# EAGLE design Grove - LED Strip driver V1.2 (EAGLE 6.4)
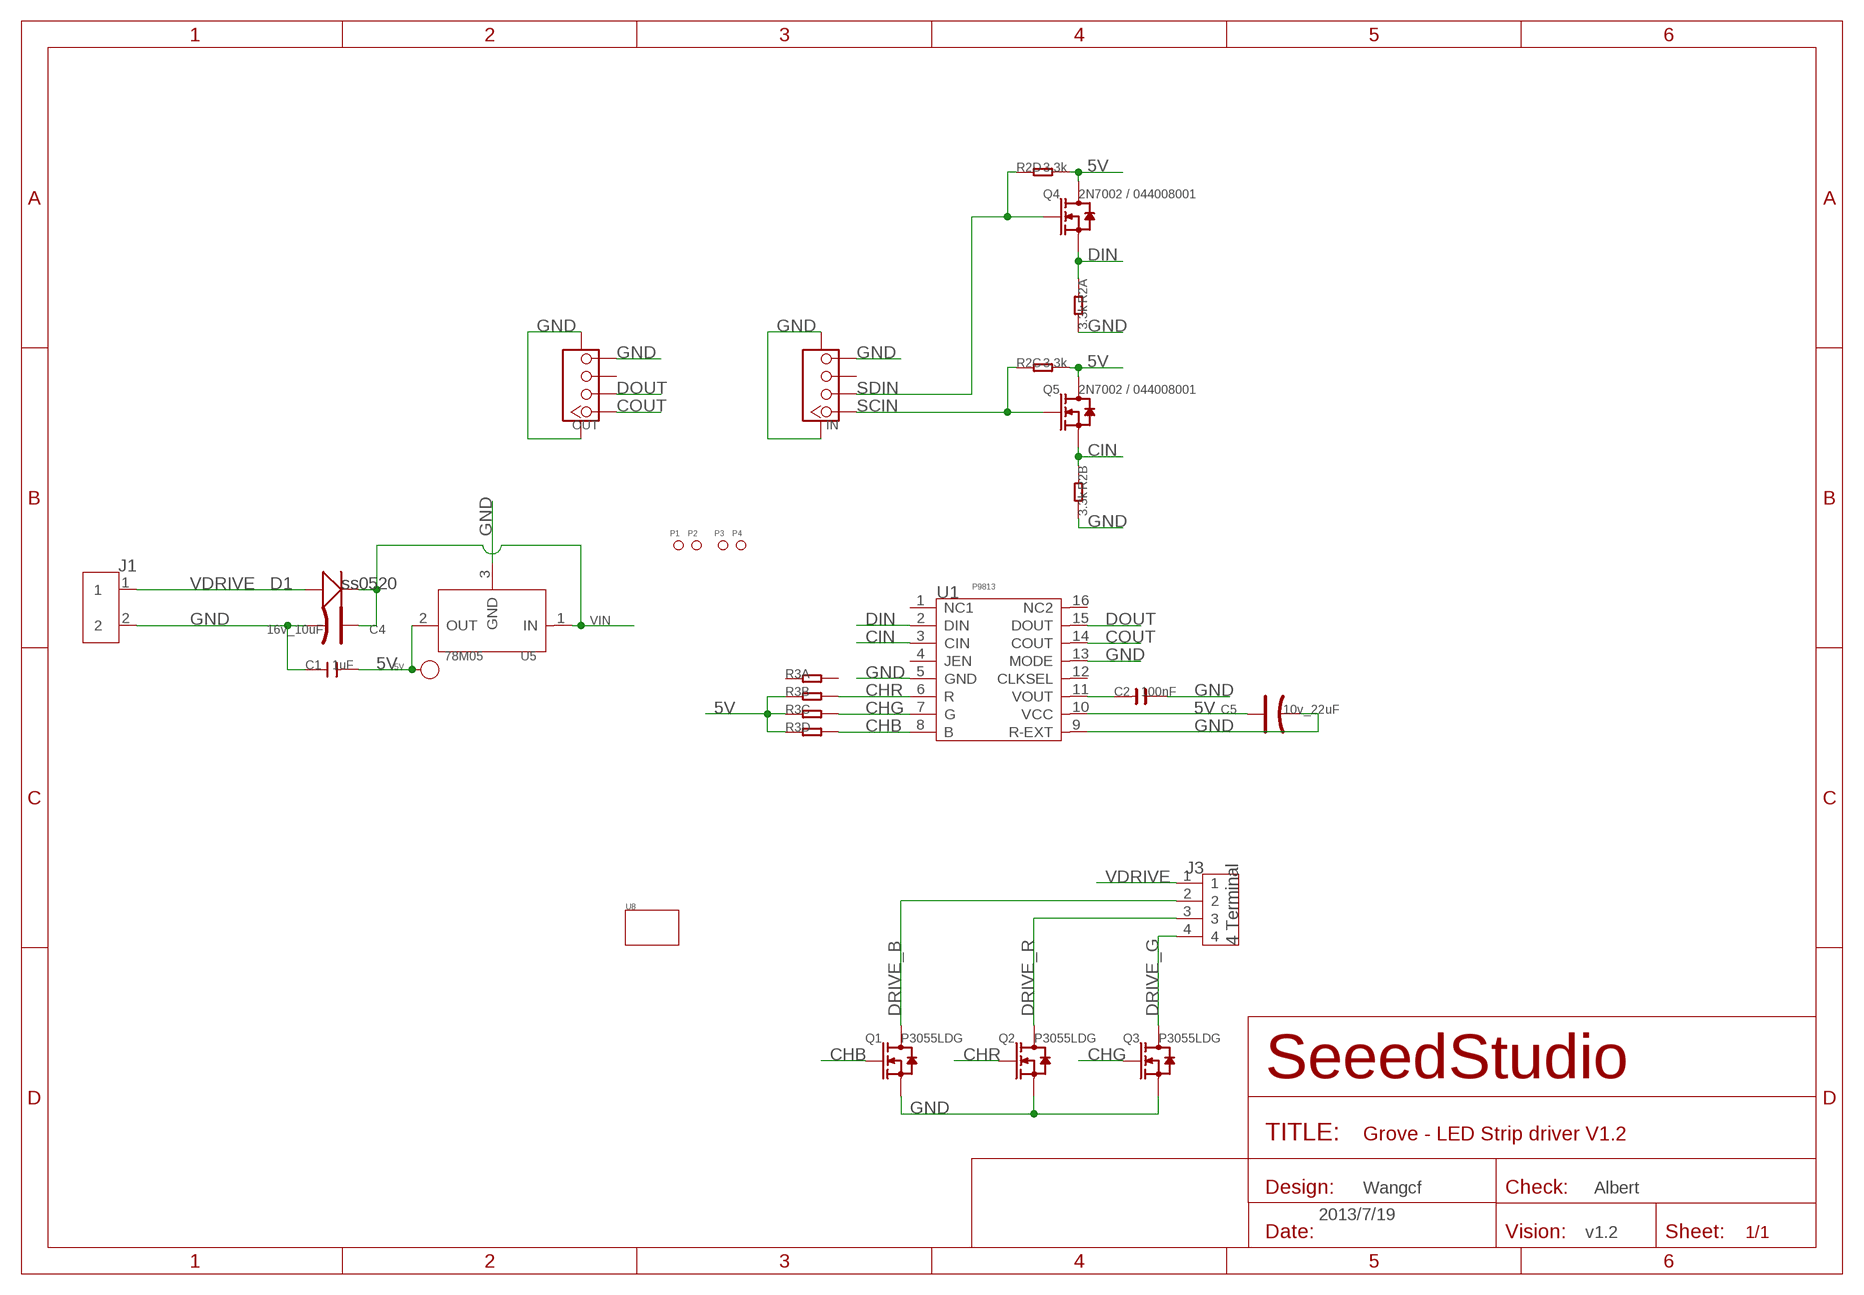
[diagram p0: schematic, sheet 1]

## Parts
5V  DNP  PAD-TEST-POINT'3535'  [TP_3535]
C1  1uF  C-0805  [C0805]
C2  100nF  C-0603  [C0603]
C4  16v_10uF  CAP-AVX-A  [AVX-A]
C5  10v_22uF  CAP-AVX-A  [AVX-A]
D1  ss0520  D'1206'  [SOD123]
IN  TWIG-4P-2.0-SMD-FEMALE-REINFORCE'DD'  [4P-SMD-2.0]
J1  SCREW-TERMINAL-2P'3.5'  [2P-3.5]
J3  4 Terminal  SCREW-TERMINAL-4P'3.5'  [4P-3.5]
OUT  TWIG-4P-2.0-SMD-FEMALE-REINFORCE'DD'  [4P-SMD-2.0]
P1  PAD-MARK  [ROUND-MARK-1.0]
P2  PAD-MARK  [ROUND-MARK-1.0]
P3  PAD-MARK  [ROUND-MARK-1.0]
P4  PAD-MARK  [ROUND-MARK-1.0]
Q1  P3055LDG  MOSFET-N'P3055LDG'  [TO252]
Q2  P3055LDG  MOSFET-N'P3055LDG'  [TO252]
Q3  P3055LDG  MOSFET-N'P3055LDG'  [TO252]
Q4  2N7002 / 044008001  MOSFET-N'SOT23'  [SOT23]
Q5  2N7002 / 044008001  MOSFET-N'SOT23'  [SOT23]
R2  3.3k  R-4R  [R1206-8]
R3  R-4R-1206  [1206-8-3.3X2.4]
U1  P9813  P9813-SSOP16  [SSOP16]
U5  78M05  78M05-TO252  [TO252]
U8  TWIG'3U'  [3U-DIM-W/-DRILL]

## Nets
5V: 5V.T C1.2 C5.+ Q4.3(D) Q5.3(D) R2.5 R2.6 R3.2 R3.3 R3.4 U1.10(VCC) U5.2(OUT)
CHB: Q1.1(G) R3.5 U1.8(B)
CHG: Q3.1(G) R3.6 U1.7(G)
CHR: Q2.1(G) R3.7 U1.6(R)
CIN: Q5.2(S) R2.2 U1.3(CIN)
COUT: OUT.1 U1.14(COUT)
DIN: Q4.2(S) R2.1 U1.2(DIN)
DOUT: OUT.2 U1.15(DOUT)
DRIVE_B: J3.2 Q1.2(D)
DRIVE_G: J3.4 Q3.2(D)
DRIVE_R: J3.3 Q2.2(D)
GND: C1.1 C2.2 C4.- C5.- IN.4 IN.SS1 IN.SS2 J1.2 OUT.4 OUT.SS1 OUT.SS2 Q1.3(S) Q2.3(S) Q3.3(S) R2.7 R2.8 U1.5(GND) U1.9(R-EXT) U1.13(MODE) U5.3(GND)
N$1: C2.1 U1.11(VOUT)
SCIN: IN.1 Q5.1(G) R2.3
SDIN: IN.2 Q4.1(G) R2.4
VDRIVE: D1.+ J1.1 J3.1
VIN: C4.+ D1.- U5.1(IN)
Unconnected: IN.3 OUT.3 R3.1 R3.8 U1.1(NC1) U1.4(JEN) U1.12(CLKSEL) U1.16(NC2)

## Notes on the sheet
- Wangcf | Albert
- 2013/7/19
- v1.2

## Library data of the parts
5V = Discrete:PAD-TEST-POINT; PARTNO: DNP
C1 = Discrete:C*: Ceramic Capacitors
C2 = OPL:C*
C4 C5 = Discrete:CAP*: Electrolytic Capacitors,Tantalum Capacitors and Super Capacitors
D1 = Discrete:D*
IN OUT = Connector :TWIG-4P-2.0-SMD-FEMALE-REINFORCE
J1 = Connector:SCREW-TERMINAL-2P
J3 = Connector:SCREW-TERMINAL-4P
P1-P4 = Discrete:PAD-MARK; PARTNO: DNP
Q1-Q5 = Discrete:MOSFET-N: IRLL014: http://www.vishay.com/docs/91319/sihll014.pdf
R2 = OPL:R-4R*: Resistor Array
R3 = Discrete:R-4R*: Resistor Array
U1 = IC:P9813-SSOP16
U5 = IC:78M05: 0.5A Three Terminal Positive Voltage Regulators
U8 = moudle:TWIG

## Board
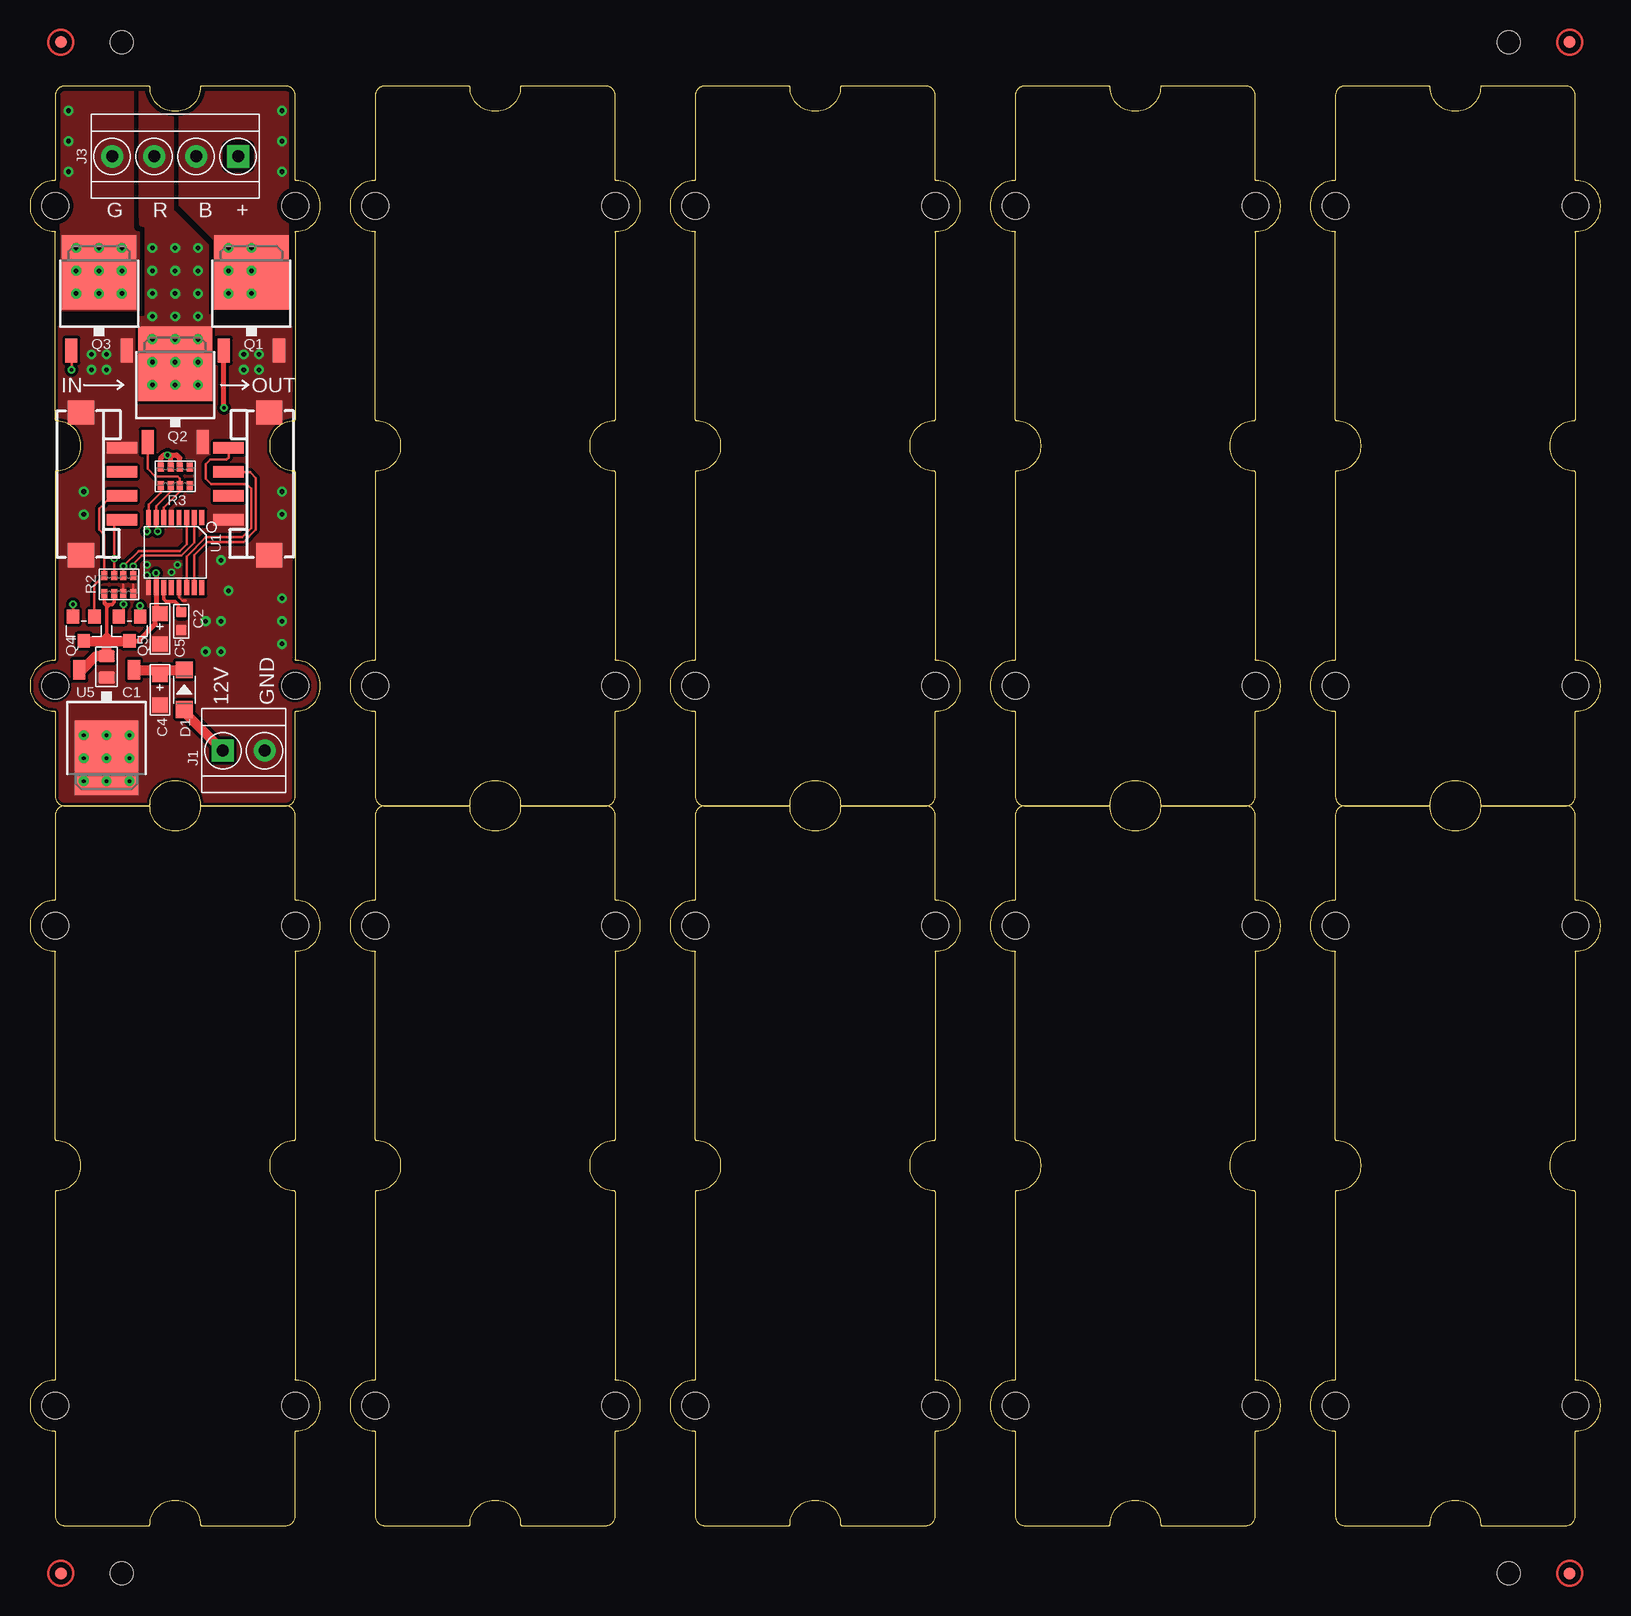
[diagram p1: board, top side]
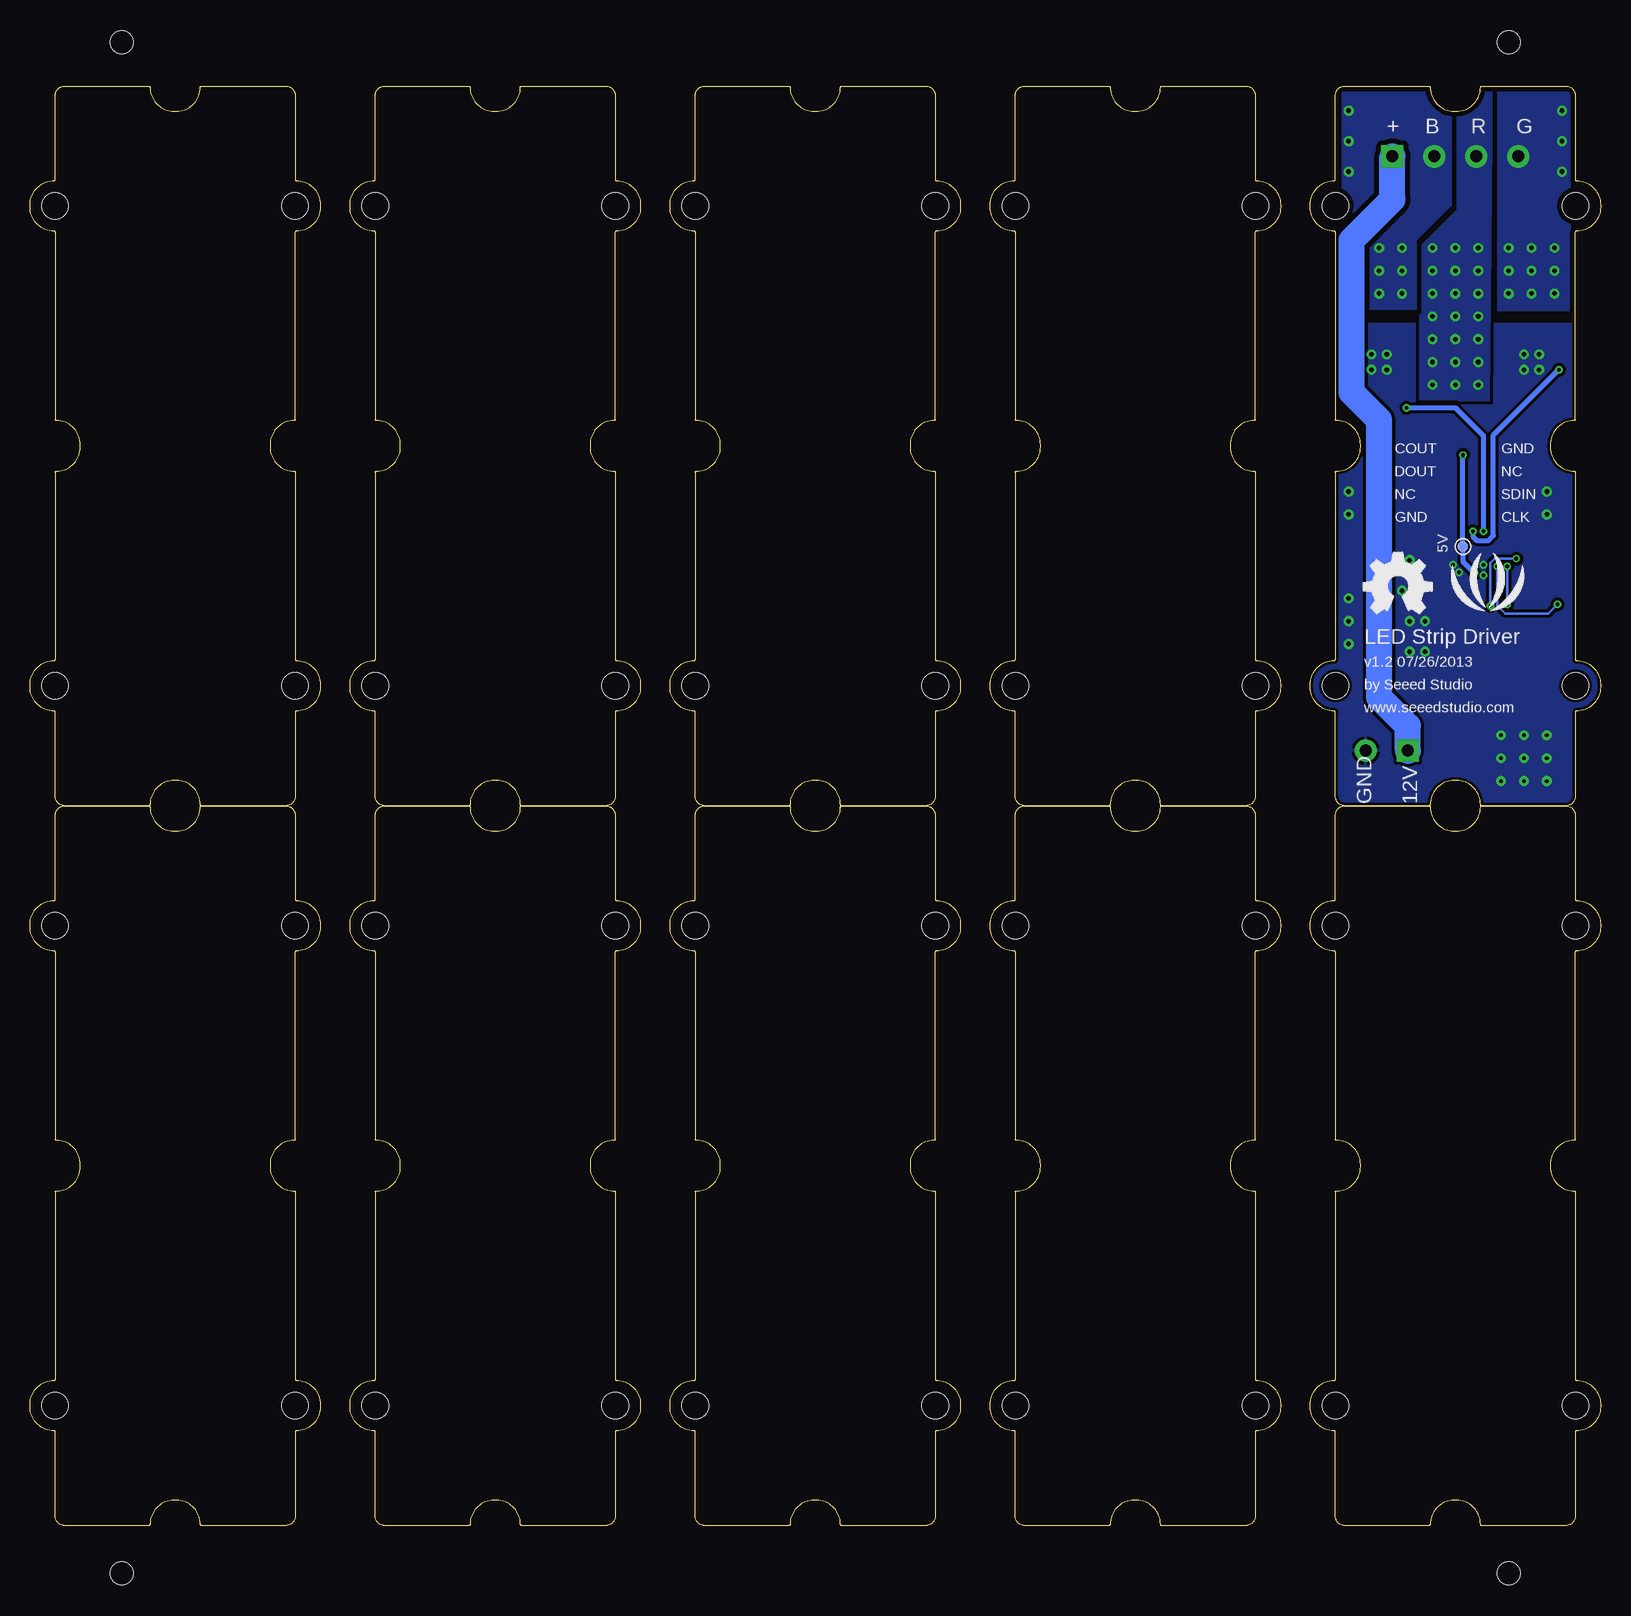
[diagram p2: board, bottom side, seen from below]

Size 130.88 x 120 mm. Coordinates in mm from the lower left corner, seen from the top.
Copper layers (1*16): Top 0.035mm / dielectric 1.5mm / Bottom 0.035mm
Design rules "SeeedStudio_DRU_no_angle_20130527 *": minimum track width 6mil, minimum drill 12mil, track to track 6mil, track to pad 6mil, pad to pad 6mil, via to via 6mil, smd to smd 0mil, copper to edge 10mil, drill to drill 10mil, minimum pad ring 10mil, minimum via ring 6mil, stop-mask expansion 2mil, vias tented up to drill 25mil, thermal gap 10mil
Holes 1.91 mm at 7.65,123.66 123.22,123.66 123.22,-3.98 7.65,-3.98
tRestrict: area 8.1,77.4 to 8.3,77.9

### Footprints (pad centres in the part's own frame; a part is rotated, then mirrored left to right if it is on the bottom)
TP_3535 = smd 0.889 x 0.889: T 0,0
C0805 = smd 1.016 x 1.397: 1 -0.889,0; 2 0.889,0
C0603 = smd 0.889 x 0.889: 1 -0.762,0; 2 0.762,0
AVX-A = smd 1.27 x 1.27: + -1.27,0; - 1.27,0
SOD123 = smd 1.397 x 1.397: + -1.651,0; - 1.651,0
4P-SMD-2.0 = smd 0.965 x 2.54: 1 -3,0; 2 -1,0; 3 1,0; 4 3,0 | smd 2.032 x 2.184: SS1 -5.946,3.4; SS2 5.946,3.4
2P-3.5 = drill 1 pad 1.85 square: 1 -1.75,0 | drill 1 pad 1.85: 2 1.75,0
4P-3.5 = drill 1 pad 1.85 square: 1 -5.25,0 | drill 1 pad 1.85: 2 -1.75,0; 3 1.75,0; 4 5.25,0
ROUND-MARK-1.0 = smd 1.016 x 1.016: P$1 0,0
TO252 = smd 1.016 x 2: 1 -2.3,-4.75; 3 2.3,-4.75 | smd 6.2 x 6.2: 2 0,1.75
SOT23 = smd 1.016 x 1.143: 1 -0.889,-1.016; 2 0.889,-1.016; 3 0,1.016
R1206-8 = smd 0.508 x 0.762: 1 -1.206,-0.762; 2 -0.381,-0.762; 3 0.381,-0.762; 4 1.206,-0.762; 5 1.206,0.762; 6 0.381,0.762; 7 -0.381,0.762; 8 -1.206,0.762
1206-8-3.3X2.4 = smd 0.508 x 0.762: 1 -1.206,-0.762; 2 -0.381,-0.762; 3 0.381,-0.762; 4 1.206,-0.762; 5 1.206,0.762; 6 0.381,0.762; 7 -0.381,0.762; 8 -1.206,0.762
SSOP16 = smd 0.406 x 1.27: 1 -2.223,-2.925; 2 -1.587,-2.925; 3 -0.953,-2.925; 4 -0.318,-2.925; 5 0.318,-2.925; 6 0.953,-2.925; 7 1.587,-2.925; 8 2.223,-2.925; 9 2.223,2.925; 10 1.587,2.925; 11 0.953,2.925; 12 0.318,2.925; 13 -0.318,2.925; 14 -0.953,2.925; 15 -1.587,2.925; 16 -2.223,2.925
3U-DIM-W/-DRILL = hole 2.2: 20,10; 20,-10; -20,-10; -20,10
TO252' = smd 1.016 x 1.651: 1 -2.286,-4.826; 2 2.286,-4.826 | smd 5.3 x 6.2: 3 0,2.5

### Placement (x,y rotation side)
5V  11.46,81.62 0 bottom
C1  6.38,71.59 90 top
C2  12.61,75.39 270 top
C4  10.83,69.68 270 top
C5  10.83,74.76 270 top
D1  12.86,69.68 90 top
IN  7.65,86.83 90 top
J1  17.81,64.6 0 top
J3  12.1,114.13 180 top
OUT  16.55,86.83 270 top
P1  2.57,-3.98 0 top  (outside the outline)
P2  128.31,-3.98 0 top  (outside the outline)
P3  2.57,123.66 0 top  (outside the outline)
P4  128.31,123.66 0 top  (outside the outline)
Q1  18.45,102.7 0 top
Q2  12.1,95.08 0 top
Q3  5.75,102.7 0 top
Q4  4.48,74.76 180 top
Q5  8.29,74.76 180 top
R2  7.4,78.44 180 top
R3  12.1,87.46 180 top
U1  12.1,81.11 180 top
U2  [3U-DIM-W/-DRILL]  12.1,30 270 top
U3  [3U-DIM-W/-DRILL]  12.1,90 270 top
U4  [3U-DIM-W/-DRILL]  38.77,30 270 top
U5  78M05  [TO252']  6.38,66.5 180 top
U6  [3U-DIM-W/-DRILL]  65.44,30 270 top
U7  [3U-DIM-W/-DRILL]  92.11,30 270 top
U8  118.78,30 270 top
U9  [3U-DIM-W/-DRILL]  38.77,90 270 top
U10  [3U-DIM-W/-DRILL]  65.44,90 270 top
U11  [3U-DIM-W/-DRILL]  92.11,90 270 top
U12  [3U-DIM-W/-DRILL]  118.78,90 270 top
U$1  [LOGO_SILK]  9.43,77.94 0 bottom
U$2  [OSHW_FILLX200_NOTEXT]  19.72,76.03 0 bottom

### Tracks (layer width: path | path; a pad name or v marks a point on that pad's centre or on a via)
5V  (via drill 0.3)
  Top 0.203: U5.2 4.23,71.2
  Top 0.305: 6.38,76.54 6.38,76.66 6.26,76.79 | R2.5 6.19,76.98 | 6.19,76.98 6.19,76.86 6.26,76.79 | R2.6 7.02,76.97 6.84,76.79 6.64,76.79 | 6.64,76.79 6.38,76.79 | 6.38,76.79 6.26,76.79 | 6.38,76.54 6.64,76.79 | 6.19,76.98 6.38,76.79 | 6.38,76.54 6.38,74.38 | 6.38,74.38 6.38,73.74 | 6.38,74.38 6.77,74 | 6.38,74.38 6,74
  Top 0.406: Q5.3 9.05,73.74 10.45,75.14 10.45,76.03 C5.+ 10.51,76.35 U1.10 v10.51,79.4 | R3.4 10.89,88.98 11.15,89.24 v11.46,89.24 11.72,89.24 | R3.2 12.48,88.98 12.23,89.24 11.72,89.24 | R3.3 11.72,89.24
  Top 0.813: 6.38,73.74 6.77,73.74 | 6.77,73.74 Q5.3 | 6.38,73.36 C1.2 5.5,72.47 4.23,71.2 | 6.38,73.36 6.38,73.74 | Q4.3 6,73.74 | 6,73.74 6.38,73.74 | 6.38,73.36 6,73.74 | 6.38,73.36 6.77,73.74
  Bottom 0.406: v11.46,89.24 5V.T 11.46,80.35 v10.51,79.4
CHB  (via drill 0.3)
  Top 0.203: R3.5 10.89,86.13 9.88,85.11 U1.8 9.88,83.02 v9.75,82.89
  Top 0.406: v16.16,93.17 16.16,97.94 Q1.1
  Bottom 0.406: v16.16,93.17 12.1,93.17 9.75,90.83 v9.75,82.89
CHG  (via drill 0.3)
  Top 0.203: R3.6 11.72,86.19 10.51,84.98 U1.7 10.51,83.02 v10.64,82.89 | v3.46,96.35 3.46,97.94 Q3.1
  Bottom 0.406: v10.64,82.89 10.64,82.44 10.32,82.13 9.31,82.13 8.93,82.51 8.93,90.89 v3.46,96.35
CHR
  Top 0.203: U1.6 11.15,84.86 12.48,86.19 R3.7 12.48,87.28 12.3,87.46 10.45,87.46 9.8,88.11 Q2.1
CIN  (via drill 0.3)
  Top 0.203: U1.3 13.05,81.81 12.48,81.24 9.05,81.24 v7.78,79.97 R2.2 | v7.78,76.79 7.78,76.16 Q5.2
  Bottom 0.203: v7.78,76.79 v7.78,79.97
COUT
  Top 0.203: U1.14 13.05,80.79 14.64,82.38 17.69,82.38 18.45,83.14 18.45,86.44 18.07,86.83 15.1,86.83 14.64,87.28 14.64,88.48 15.02,88.86 16.36,88.86 16.55,89.04 OUT.1
DIN  (via drill 0.3)
  Top 0.203: U1.2 13.69,81.94 12.61,80.86 9.31,80.86 8.61,80.16 v8.61,79.97 R2.1 | v3.59,76.79 Q4.2
  Bottom 0.203: v8.61,79.97 8.61,76.69 7.94,76.03 4.35,76.03 v3.59,76.79
DOUT
  Top 0.203: OUT.2 18.34,87.83 18.83,87.33 18.83,83.02 17.81,82 14.77,82 13.69,80.92 U1.15
DRIVE_B  (via drill 0.38 pad 0.81)
  other vias: 16.55,104.61 16.55,102.7 20.99,117.94 20.99,115.4 20.99,112.86 18.45,102.7 18.45,104.61 16.55,106.51 18.45,106.51
  pour Top (isolate 0.406, rank 2, no thermals): 15.4,101.43 15.4,107.14 12.48,110.07 12.48,119.72 21.5,119.72 21.5,101.43
  pour Bottom (isolate 0.406, rank 2, no thermals): 15.4,101.43 15.4,107.14 12.48,110.07 12.48,119.72 21.5,119.72 21.5,101.43
DRIVE_G  (via drill 0.38 pad 0.81)
  other vias: 5.75,106.51 7.65,104.61 7.65,102.7 5.75,102.7 5.75,104.61 3.84,104.61 3.84,102.7 3.84,106.51 3.21,112.86 3.21,115.4 3.21,117.94 7.65,106.51
  pour Top (isolate 0.406, rank 2, no thermals): 2.57,101.3 9.05,101.3 9.05,107.78 arc-90 8.54,108.29 8.54,119.84 2.57,119.84
  pour Bottom (isolate 0.406, rank 2, no thermals): 2.57,101.3 8.54,101.3 8.54,119.84 2.57,119.84
DRIVE_R  (via drill 0.38 pad 0.81)
  other vias: 12.1,96.98 12.1,95.08 12.1,98.89 12.1,100.8 12.1,102.7 10.2,102.7 10.2,100.8 14,100.8 14,98.89 10.2,98.89 14,96.98 10.2,96.98 14,95.08 10.2,95.08 14,102.7 14,104.61 12.1,104.61 10.2,104.61 10.2,106.51 12.1,106.51 14,106.51
  pour Top (isolate 0.406, rank 3, no thermals): 11.97,119.84 9.05,119.84 9.31,93.81 15.02,93.81 15.02,107.02 11.97,110.07
  pour Bottom (isolate 0.406, rank 3, no thermals): 11.97,119.84 9.05,119.84 9.31,93.81 15.02,93.81 15.02,107.02 11.97,110.07
GND  (via drill 0.3 pad 0.64, 0.3 pad 0.81, 0.38 pad 0.81)
  Top 0.203: R2.8 8.61,78.44 | R2.7 7.78,78.44 | U1.13 12.42,77.36 12.67,77.11 12.99,77.11
  other vias: 20.99,86.19 15.91,75.39 6.38,96.35 6.38,65.87 6.38,63.97 6.38,62.06 4.48,65.87 4.48,63.97 4.48,62.06 8.29,62.06 8.29,63.97 8.29,65.87 5.11,96.35 6.38,97.62 5.11,97.62 20.99,84.28 20.99,73.49 20.99,75.39 17.81,96.35 19.09,96.35 19.09,97.62 17.81,97.62 15.91,72.86 4.48,84.28 4.48,86.19 9.75,79.2 11.78,79.46 9.75,80.09 12.29,80.09 16.55,77.94 20.99,77.3 15.91,80.47 14.64,75.39 14.64,72.86
  pour Top (isolate 0.254, rank 6, no thermals): -0.6,99.91 24.16,99.91 24.16,58.25 -0.6,58.25
  pour Bottom (isolate 0.254, rank 6): -0.6,58.25 -0.6,100.16 24.16,100.16 24.16,58.25
N$1
  Top 0.305: U1.11 11.15,77.24 11.34,77.05 12.1,77.05 12.35,76.79 12.35,76.41 C2.1
SCIN  (via drill 0.3)
  Top 0.203: R2.3 7.02,80.35 v7.02,80.6 7.02,83.78 7.61,83.78 IN.1 | Q5.1 v9.18,76.66
  Bottom 0.203: v9.18,76.66 9.18,80.22 8.8,80.6 v7.02,80.6
SDIN
  Top 0.203: IN.2 7.64,85.81 6.77,85.81 5.75,84.79 5.75,83.02 6.19,82.57 R2.4 5.78,78.79 5.5,78.51 5.37,78.38 Q4.1
VDRIVE
  Top 0.813: D1.+ 12.86,67.8 J1.1
  Bottom 2.184: J1.1 16.06,66.66 18.45,69.05 18.45,92.16 20.74,94.44 20.74,107.14 17.35,110.53 J3.1
VIN
  Top 0.813: U5.1 10.83,71.33 | 10.83,71.33 D1.- | C4.+ 10.83,71.33

### Text on the board
tPlace: G | R | B | + | 12V | GND
bPlace: G | R | B | + | GND | COUT | NC | DOUT | SDIN | NC | CLK | GND | LED Strip Driver | v1.2 07/26/2013 | by Seeed Studio | www.seeedstudio.com | 12V | GND
tStop: GND | CLK